# Altium schematic sheet LCD.SchDoc
size A
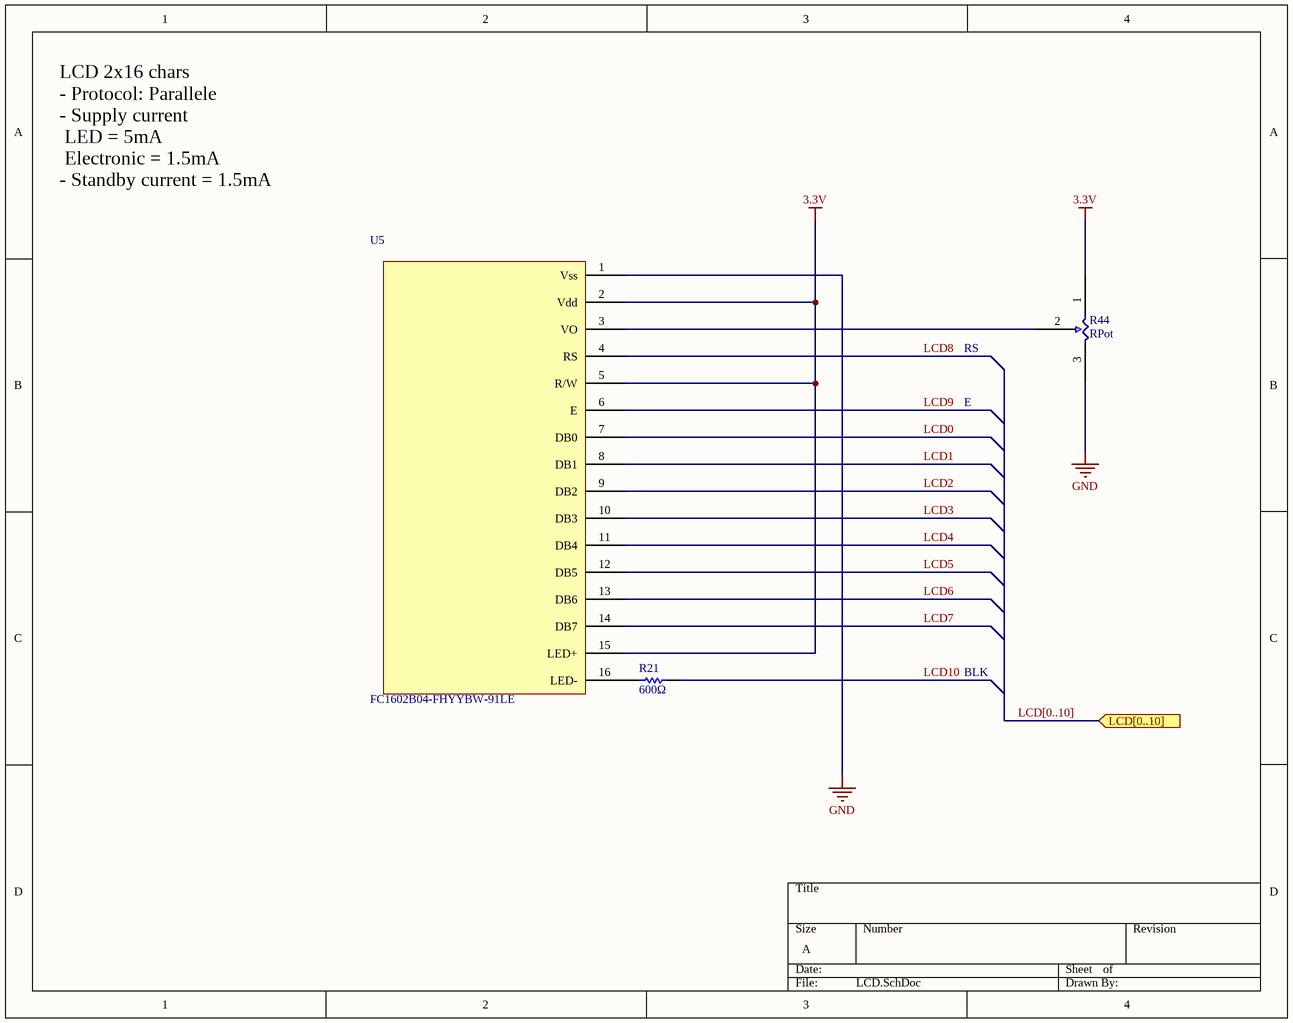
[diagram p0: LCD.SchDoc]

## Parts
R21  600Ω  [R0603]
R44  RPot  [POTARD]
U5  FC1602B04-FHYYBW-91LE  [FC1602B04-FHYYBW-91LE]

## Ports
LCD[0..10] (in)

## Nets
3.3V: R44.1 U5.2(Vdd) U5.5(R/W) U5.15(LED+)
GND: R44.3 U5.1(Vss)
LCD0: U5.7(DB0)
LCD1: U5.8(DB1)
LCD2: U5.9(DB2)
LCD3: U5.10(DB3)
LCD4: U5.11(DB4)
LCD5: U5.12(DB5)
LCD6: U5.13(DB6)
LCD7: U5.14(DB7)
LCD8: U5.4(RS)
LCD9: U5.6(E)
LCD10: R21.2
NetR21_1: R21.1 U5.16(LED-)
NetR44_2: R44.2 U5.3(VO)

## Buses and harness runs
bus LCD[0..10] =  = port LCD[0..10]

## Notes on the sheet
- LCD 2x16 chars
  - Protocol: Parallele
  - Supply current
  LED	= 5mA
  Electronic	= 1.5mA
  - Standby current = 1.5mA
- RS
- E
- BLK

## Library data of the parts
R21 = Res1: Resistor; Manufacturer: MULTICOMP; Value: 1K; Published: 8-Jun-2000; LatestRevisionDate: 17-Jul-2002; LatestRevisionNote: Re-released for DXP Platform.; PackageReference: AXIAL-0.3; Publisher: Altium Limited; PackageDescription: Axial Device, Thru-Hole; 2 Leads; 0.3 in Pin Spacing; Ref.Farnell: ?; Supplier: Farnell
R44 = Potard: Varistor; Manufacturer: VISHAY; Ref.Manufacturer: T73YE103KT20; Ref.Farnell: 2550676; Supplier: Farnell
U5 = FC1602B04-FHYYBW-91LE: LCD; Manufacturer: FORDATA; Ref.Farnell: 2674137; Ref.Manufacturer: FC1602B04-FHYYBW-91LE; Supplier: Farnell